# Altium schematic sheet EEG Front-End.SchDoc
size A4
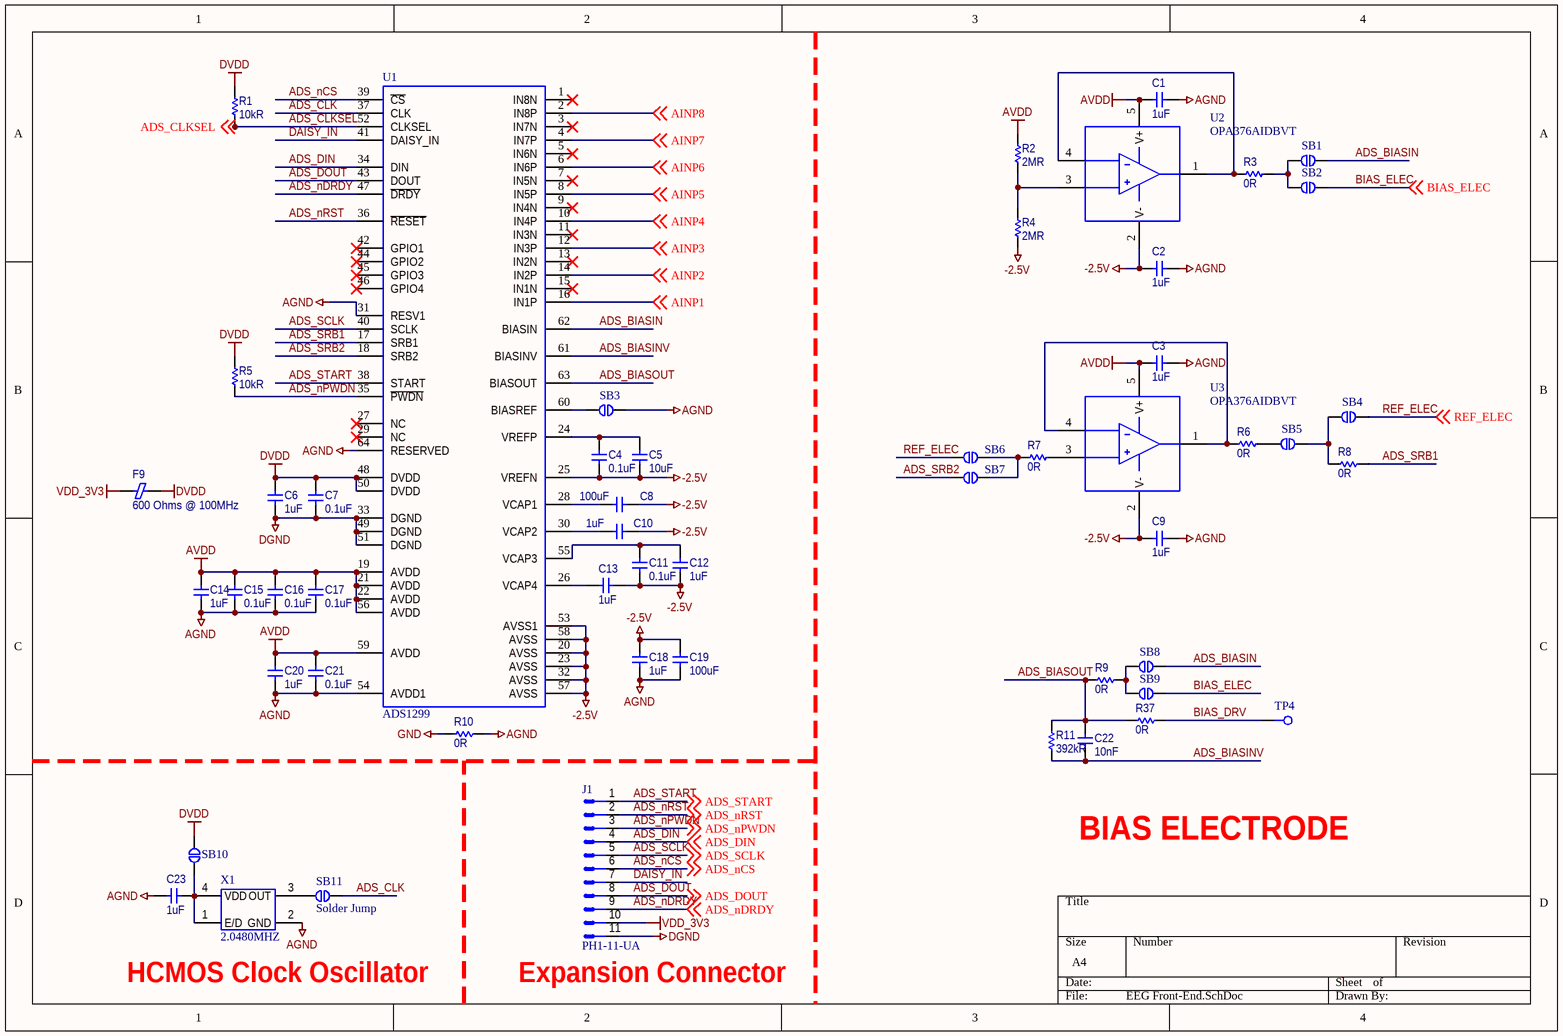
[diagram p0: EEG Front-End.SchDoc]

## Parts
C1  1uF  [C1005X04N]
C2  1uF  [C1005X04N]
C3  1uF  [C1005X04N]
C4  0.1uF  [C1005X04N]
C5  10uF  [C1608X06N]
C6  1uF  [C1005X04N]
C7  0.1uF  [C1005X04N]
C8  100uF  [C2012X06N]
C9  1uF  [C1005X04N]
C10  1uF  [C1005X04N]
C11  0.1uF  [C1005X04N]
C12  1uF  [C1005X04N]
C13  1uF  [C1005X04N]
C14  1uF  [C1005X04N]
C15  0.1uF  [C1005X04N]
C16  0.1uF  [C1005X04N]
C17  0.1uF  [C1005X04N]
C18  1uF  [C1005X04N]
C19  100uF  [C2012X06N]
C20  1uF  [C1005X04N]
C21  0.1uF  [C1005X04N]
C22  10nF  [C1005X04N]
C23  1uF  [C1005X04N]
F9  600 Ohms @ 100MHz  [F1005X04N]
J1  PH1-11-UA  [HDR1x11 - 2.54mm]
R1  10kR  [R1005X04N]
R2  2MR  [R1005X04N]
R3  0R  [R1005X04N]
R4  2MR  [R1005X04N]
R5  10kR  [R1005X04N]
R6  0R  [R1005X04N]
R7  0R  [R1005X04N]
R8  0R  [R1005X04N]
R9  0R  [R1005X04N]
R10  0R  [R1005X04N]
R11  392kR  [R1005X04N]
R37  0R  [R1005X04N]
SB1  Solder Jump  [SJB_0603]  (value not drawn)
SB2  Solder Jump  [SJB_0603]  (value not drawn)
SB3  Solder Jump  [SJB_0603]  (value not drawn)
SB4  Solder Jump  [SJB_0603]  (value not drawn)
SB5  Solder Jump  [SJB_0603]  (value not drawn)
SB6  Solder Jump  [SJB_0603]  (value not drawn)
SB7  Solder Jump  [SJB_0603]  (value not drawn)
SB8  Solder Jump  [SJB_0603]  (value not drawn)
SB9  Solder Jump  [SJB_0603]  (value not drawn)
SB10  Solder Jump  [SJB_0603]  (value not drawn)
SB11  Solder Jump  [SJB_0603]
TP4  TP_25MILC  [TESTPOINT_1MM]  (value not drawn)  (no BOM)
U1  ADS1299  [PQFN-64]
U2  OPA376AIDBVT  [SOT23-5]
U3  OPA376AIDBVT  [SOT23-5]
X1  2.0480MHZ  [CRYSTAL_3225]

## Nets
-2.5V: C2.2 C4.1 C5.1 C8.2 C9.2 C10.2 C11.1 C12.2 C13.1 C18.2 C19.2 R4.1 U1.20(AVSS) U1.23(AVSS) U1.25(VREFN) U1.32(AVSS) U1.53(AVSS1) U1.57(AVSS) U1.58(AVSS) U2.2(V-) U3.2(V-)
AGND: C1.1 C2.1 C3.1 C9.1 C14.2 C15.1 C16.1 C17.1 C18.1 C19.1 C20.2 C21.1 C23.1 R10.2 SB3.1 U1.31(RESV1) U1.54(AVDD1) U1.64(RESERVED) X1.2(GND)
AVDD: C1.2 C3.2 C14.1 C15.2 C16.2 C17.2 C20.1 C21.2 R2.2 U1.19(AVDD) U1.21(AVDD) U1.22(AVDD) U1.56(AVDD) U1.59(AVDD) U2.5(V+) U3.5(V+)
DGND: C6.2 C7.1 J1.11 U1.33(DGND) U1.49(DGND) U1.51(DGND)
DVDD: C6.1 C7.2 F9.2 R1.2 R5.2 SB10.1 U1.48(DVDD) U1.50(DVDD)
GND: R10.1
VDD_3V3: F9.1 J1.10
ADS_BIASIN: SB1.1 SB8.1 U1.62(BIASIN)
ADS_BIASINV: C22.1 R11.1 U1.61(BIASINV)
ADS_BIASOUT: C22.2 R9.1 R11.2 R37.1 U1.63(BIASOUT)
ADS_CLK: SB11.2 U1.37(CLK)
ADS_CLKSEL: R1.1 U1.52(CLKSEL) ; off-sheet ADS_CLKSEL
ADS_DIN: J1.4 U1.34(DIN) ; off-sheet ADS_DIN
ADS_DOUT: J1.8 U1.43(DOUT) ; off-sheet ADS_DOUT
ADS_nCS: J1.6 U1.39(~{CS}) ; off-sheet ADS_nCS
ADS_nDRDY: J1.9 U1.47(~{DRDY}) ; off-sheet ADS_nDRDY
ADS_nPWDN: J1.3 R5.1 U1.35(~{PWDN}) ; off-sheet ADS_nPWDN
ADS_nRST: J1.2 U1.36(~{RESET}) ; off-sheet ADS_nRST
ADS_SCLK: J1.5 U1.40(SCLK) ; off-sheet ADS_SCLK
ADS_SRB1: R8.2 U1.17(SRB1)
ADS_SRB2: SB7.2 U1.18(SRB2)
ADS_START: J1.1 U1.38(START) ; off-sheet ADS_START
AINP1: U1.16(IN1P) ; off-sheet AINP1
AINP2: U1.14(IN2P) ; off-sheet AINP2
AINP3: U1.12(IN3P) ; off-sheet AINP3
AINP4: U1.10(IN4P) ; off-sheet AINP4
AINP5: U1.8(IN5P) ; off-sheet AINP5
AINP6: U1.6(IN6P) ; off-sheet AINP6
AINP7: U1.4(IN7P) ; off-sheet AINP7
AINP8: U1.2(IN8P) ; off-sheet AINP8
BIAS_DRV: R37.2 TP4.1
BIAS_ELEC: SB2.1 SB9.1 ; off-sheet BIAS_ELEC
DAISY_IN: J1.7 U1.41(DAISY_IN)
REF_ELEC: SB4.2 SB6.2 ; off-sheet REF_ELEC
NetC4_2: C4.2 C5.2 U1.24(VREFP)
NetC8_1: C8.1 U1.28(VCAP1)
NetC10_1: C10.1 U1.30(VCAP2)
NetC11_2: C11.2 C12.1 U1.55(VCAP3)
NetC13_2: C13.2 U1.26(VCAP4)
NetC23_2: C23.2 SB10.2 X1.1(E/D) X1.4(VDD)
NetR2_1: R2.1 R4.2 U2.3(IN+)
NetR3_1: R3.1 U2.1(VO) U2.4(IN-)
NetR3_2: R3.2 SB1.2 SB2.2
NetR6_1: R6.1 U3.1(VO) U3.4(IN-)
NetR6_2: R6.2 SB5.2
NetR7_1: R7.1 SB6.1 SB7.1
NetR7_2: R7.2 U3.3(IN+)
NetR8_1: R8.1 SB4.1 SB5.1
NetR9_2: R9.2 SB8.2 SB9.2
NetSB3_2: SB3.2 U1.60(BIASREF)
NetSB11_1: SB11.1 X1.3(OUT)

Not connected (* = marked no-connect by the designer): U1 1(IN8N)* 3(IN7N)* 5(IN6N)* 7(IN5N)* 9(IN4N)* 11(IN3N)* 13(IN2N)* 15(IN1N)* 27(NC)* 29(NC)* 42(GPIO1)* 44(GPIO2)* 45(GPIO3)* 46(GPIO4)*

## Notes on the sheet
- BIAS ELECTRODE
- (near X1) HCMOS Clock Oscillator
- (near J1) Expansion Connector

## Library data of the parts
C1-C3 C6 C9 C10 C12-C14 C18 C20 C23 = EMK105BJ105KV-F: CAP CER,1UF,10%,16V,X5R,0402,SMD; Manufacturer: Taiyo Yuden; No: 96; Capacitor Type: Ceramic Capacitor; Manufacturer Part Number: EMK105BJ105KV-F; VNPT Part Number: EMK105BJ105KV-F; Capacitance: 1uF; Voltage - Rated: 16V; Tolerance: 10%; Mounting Type: Surface Mount (SMD); Package: 0402; Temperature Coefficient: X5R
C4 C7 C11 C15-C17 C21 = TMK105BJ104MV-F: CAP CER,0.1UF,20%,25V,X5R,0402,SMD; Manufacturer: Taiyo Yuden; No: 79; Capacitor Type: Ceramic Capacitor; Manufacturer Part Number: TMK105BJ104MV-F; VNPT Part Number: TMK105BJ104MV-F; Capacitance: 0.1uF; Voltage - Rated: 25V; Tolerance: 20%; Mounting Type: Surface Mount (SMD); Package: 0402; Temperature Coefficient: X5R
C5 = LMK107BBJ106MAHT: CAP CER,10UF,20%,10V,X5R,0603,SMD; Manufacturer: Taiyo Yuden; No: 31; Capacitor Type: Ceramic Capacitor; Manufacturer Part Number: LMK107BBJ106MAHT; VNPT Part Number: LMK107BBJ106MAHT; Capacitance: 10uF; Voltage - Rated: 10V; Tolerance: 20%; Mounting Type: Surface Mount (SMD); Package: 0603; Temperature Coefficient: X5R
C8 C19 = GRM21BR60J107ME15L: CAP CER,100UF,20%,6.3V,X5R,0805,SMD; Manufacturer: Murata Electronics; No: 71; Capacitor Type: Ceramic Capacitor; Manufacturer Part Number: GRM21BR60J107ME15L; VNPT Part Number: GRM21BR60J107ME15L; Capacitance: 100uF; Voltage - Rated: 6.3V; Tolerance: 20%; Mounting Type: Surface Mount (SMD); Package: 0805; Temperature Coefficient: X5R
C22 = UMK105B7103KV-F: CAP CER,10NF,10%,50V,X7R,0402,SMD; Manufacturer: Taiyo Yuden; No: 33; Capacitor Type: Ceramic Capacitor; Manufacturer Part Number: UMK105B7103KV-F; VNPT Part Number: UMK105B7103KV-F; Capacitance: 10nF; Voltage - Rated: 50V; Tolerance: 10%; Mounting Type: Surface Mount (SMD); Package: 0402; Temperature Coefficient: X7R
F9 = BK1005HS601-T: FERRITE BEAD,600 OHMS @ 100MHZ,0.55R,300MA,0402,SMD; Manufacturer: Taiyo Yuden; No: 3; Manufacturer Part Number: BK1005HS601-T; VNPT Part Number: BK1005HS601-T; Impedance: 600 Ohms @ 100MHz; DC Resistance (DCR): 0.55R; Current Rating: 300mA; Mounting Type: Surface Mount (SMD); Package: 0402
J1 = PH1-11-UA: CONN HEADER VERT 11POS 2.54MM
R1 R5 = RC0402FR-0710KL: RES,10KR,1%,62.5MW,0402,SMD; Manufacturer: Yageo; No: 35; Manufacturer Part Number: RC0402FR-0710KL; VNPT Part Number: RC0402FR-0710KL; Resistance: 10kR; Tolerance: 1%; Power: 62.5mW; Resistor Type: Genneral Purpose Resistor; Mounting Type: Surface Mount (SMD); Package: 0402
R2 R4 = CRCW04022M00FKEDC: RES,2MR,1%,62.5MW,0402,SMD; Manufacturer: Vishay / Dale; No: 135; Manufacturer Part Number: CRCW04022M00FKEDC; VNPT Part Number: CRCW04022M00FKEDC; Resistance: 2MR; Tolerance: 1%; Power: 62.5mW; Resistor Type: Genneral Purpose Resistor; Mounting Type: Surface Mount (SMD); Package: 0402
R3 R6-R10 R37 = RC0402FR-070RL: RES,0R,JUMPER,62.5MW,0402,SMD; Manufacturer: Yageo; No: 7; Manufacturer Part Number: RC0402FR-070RL; VNPT Part Number: RC0402FR-070RL; Resistance: 0R; Tolerance: JUMPER; Power: 62.5mW; Resistor Type: Genneral Purpose Resistor; Mounting Type: Surface Mount (SMD); Package: 0402
R11 = CRCW0402392KFKED: RES,392KR,1%,62.5MW,0402,SMD; Manufacturer: Vishay / Dale; No: 136; Manufacturer Part Number: CRCW0402392KFKED; VNPT Part Number: CRCW0402392KFKED; Resistance: 392kR; Tolerance: 1%; Power: 62.5mW; Resistor Type: Genneral Purpose Resistor; Mounting Type: Surface Mount (SMD); Package: 0402
SB1-SB11 = Solder Jump: Solder Bridge Jumper 0603
TP4 = TP_25MILC: Test Point 25mil
U1 = ADS1299IPAGR: IC AFE 8 CHAN 24BIT 64TQFP; Manufacturer: Texas Instruments; Manufacturer Part Number: ADS1299IPAGR
U2 U3 = OPA376AIDBVT: IC OPAMP GP 1 CIRCUIT SOT23-5; Manufacturer: Texas Instruments; Manufacturer Part Number: OPA376AIDBVT
X1 = 632L3I002M04800: XTAL OSC XO 2.0480MHZ HCMOS SMD; Manufacturer: CTS-Frequency Controls; Parameter 1: *